# Altium schematic sheet DenHoc_Arduino.SchDoc
size A0
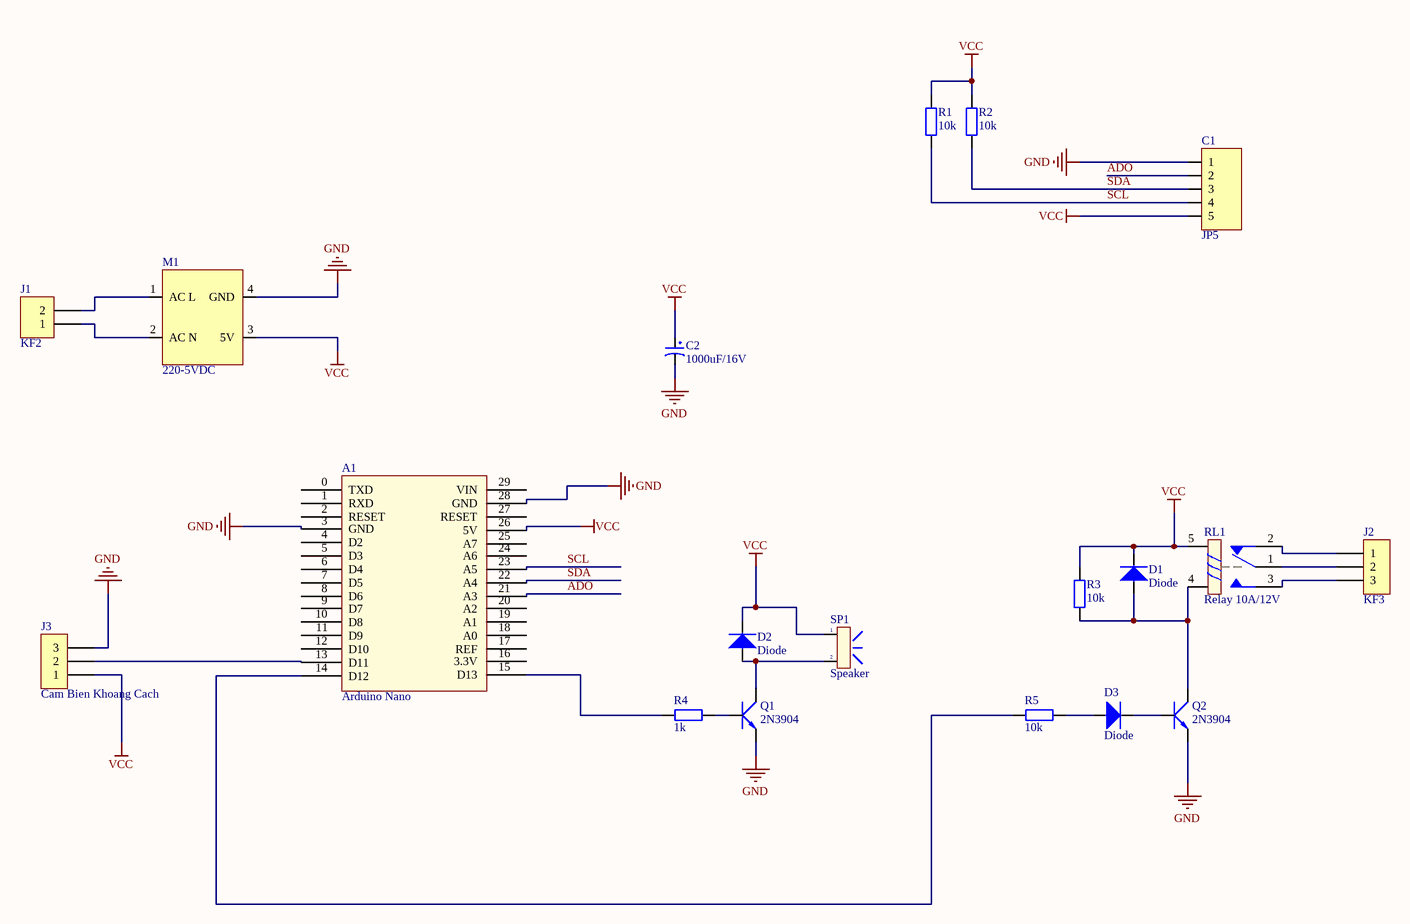
[diagram p0: DenHoc_Arduino.SchDoc]

## Parts
A1  Arduino Nano  [Arduino Nano_JUMP]
C1  JP5  [JP5-C1T]
C2  1000uF/16V  [CP1.5/3.4]
D1  Diode  [DIO-SMD-106]
D2  Diode  [DIO-SMD-106]
D3  Diode  [DIO-SMD-106]
J1  KF2  [KF2-3.5]
J2  KF3  [KF3-5.08]
J3  Cam Bien Khoang Cach  [KF3-5.08]
M1  220-5VDC  [5V 700mA 3.5W AC DC]
Q1  2N3904  [TO92-123]
Q2  2N3904  [TO92-123]
R1  10k  [RES-1/4W]
R2  10k  [RES-1/4W]
R3  10k  [RES-1/4W]
R4  1k  [RES-1/4W]
R5  10k  [RES-1/4W]
RL1  Relay 10A/12V  [RL_SPDT_10A]
SP1  Speaker  [SPK]

## Nets
GND: A1.3(GND) A1.28(GND) C1.1 C2.2 J3.3 M1.4(GND) Q1.1(E) Q2.1(E)
VCC: A1.26(5V) C1.5 C2.1 D1.2 D2.2 J3.1 M1.3(5V) R1.2 R2.2 R3.2 RL1.5 SP1.1
ADO: A1.21(A3) C1.2
SCL: A1.23(A5) C1.4 R1.1
SDA: A1.22(A4) C1.3 R2.1
NetA1_13: A1.13(D11) J3.2
NetA1_14: A1.14(D12) R5.2
NetA1_15: A1.15(D13) R4.2
NetD1_1: D1.1 Q2.3(C) R3.1 RL1.4
NetD2_1: D2.1 Q1.3(C) SP1.2
NetD3_1: D3.1 R5.1
NetD3_2: D3.2 Q2.2(B)
NetJ1_1: J1.1 M1.2(AC_N)
NetJ1_2: J1.2 M1.1(AC_L)
NetJ2_1: J2.1 RL1.2
NetJ2_2: J2.2 RL1.1
NetJ2_3: J2.3 RL1.3
NetQ1_2: Q1.2(B) R4.1

Not connected (* = marked no-connect by the designer): A1 0(TXD) 1(RXD) 2(RESET) 4(D2) 5(D3) 6(D4) 7(D5) 8(D6) 9(D7) 10(D8) 11(D9) 12(D10) 16(3.3V) 17(REF) 18(A0) 19(A1) 20(A2) 24(A6) 25(A7) 27(RESET) 29(VIN)

## Library data of the parts
C1 = JP5: WR-PHD 2.54 mm Angled Socket Header; Manufacturer: W¨¹rth Elektronik eiSos GmbH; partNo: 613005143121; ComponentLink1 Description: Manufacturer; ComponentLink2 Description: Datasheet; NoPins: 05; Created Date: 29 March 2013; ComponentLink1URL: http://www.we-online.com; ComponentLink2URL: http://katalog.we-online.de/em/datasheet/6130xx143121.pdf; Created by: Karrer Zheng
C2 = CP4: Cap 1000uF/16V - 220uF/50V; Description 5: 4,7uF>10uF/250V_3,3uF>10uF/400V - 2,2uF>4,7uF/450V; Description 1: 2200uF-3300uF/6,3V - 1000uF-2200uF/10V; Description 2: 1000uF/16V - 470uF => 1000uF/25V - 100uF/100V; Description 3: 330uF>470uF/35V_220uF>470uF/50V_10uF>22uF/250V; Description 4: 220uF => 330uF/63V - 10uF =>33uF/160 - 200V; Value: 1000uF/16V
J1 = KF2: Manufacturer: Würth Elektronik eiSos GmbH; partNo: 691103110002; ComponentLink1 Description: Manufacturer; ComponentLink2 Description: Datasheet; NoPins: 2; Created Date: 29 October 2013; ComponentLink1URL: http://www.we-online.com; ComponentLink2URL: http://katalog.we-online.de/em/datasheet/6911031100xx.pdf; Created by: Karrer Zheng
J2 J3 = KF3: Manufacturer: Würth Elektronik eiSos GmbH; partNo: 691103110003; ComponentLink1 Description: Manufacturer; ComponentLink2 Description: Datasheet; NoPins: 3; Created Date: 29 October 2013; ComponentLink1URL: http://www.we-online.com; ComponentLink2URL: http://katalog.we-online.de/em/datasheet/6911031100xx.pdf; Created by: Karrer Zheng
M1 = 5V 700mA 3.5W AC 220 to DC
Q1 Q2 = 2N3904: NPN 600mW, ECB; Value: C1815
R1-R5 = R: Resistor R1/4W
RL1 = Relay 1: Relay SPDT,10A - 12VDC 5 Pin; Value: Relay SPDT, 10A, 12V
SP1 = SPK: Speaker Chip; Value: Speaker Chip